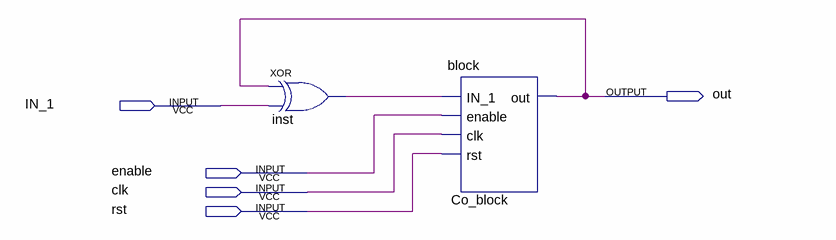
[diagram p0: schematic sheet]
// Quartus schematic bblock.bdf as structural Verilog: 2 symbols, 5 pins
module bblock (
  input  IN_1,
  input  enable,
  input  clk,
  input  rst,
  output out
);

  wire inst_out;

  xor inst (inst_out, out, IN_1);
  block Co_block (.IN_1(inst_out), .enable(enable), .clk(clk), .rst(rst), .out(out));
endmodule
